# Altium schematic sheet Sheet5.SchDoc
size A3; Organization: Altium Limited; Address1: L3, 12a Rodborough Rd; Address2: Frenchs Forest; Address3: NSW; Address4: Australia 2086; SheetNumber: 5; SheetTotal: 6
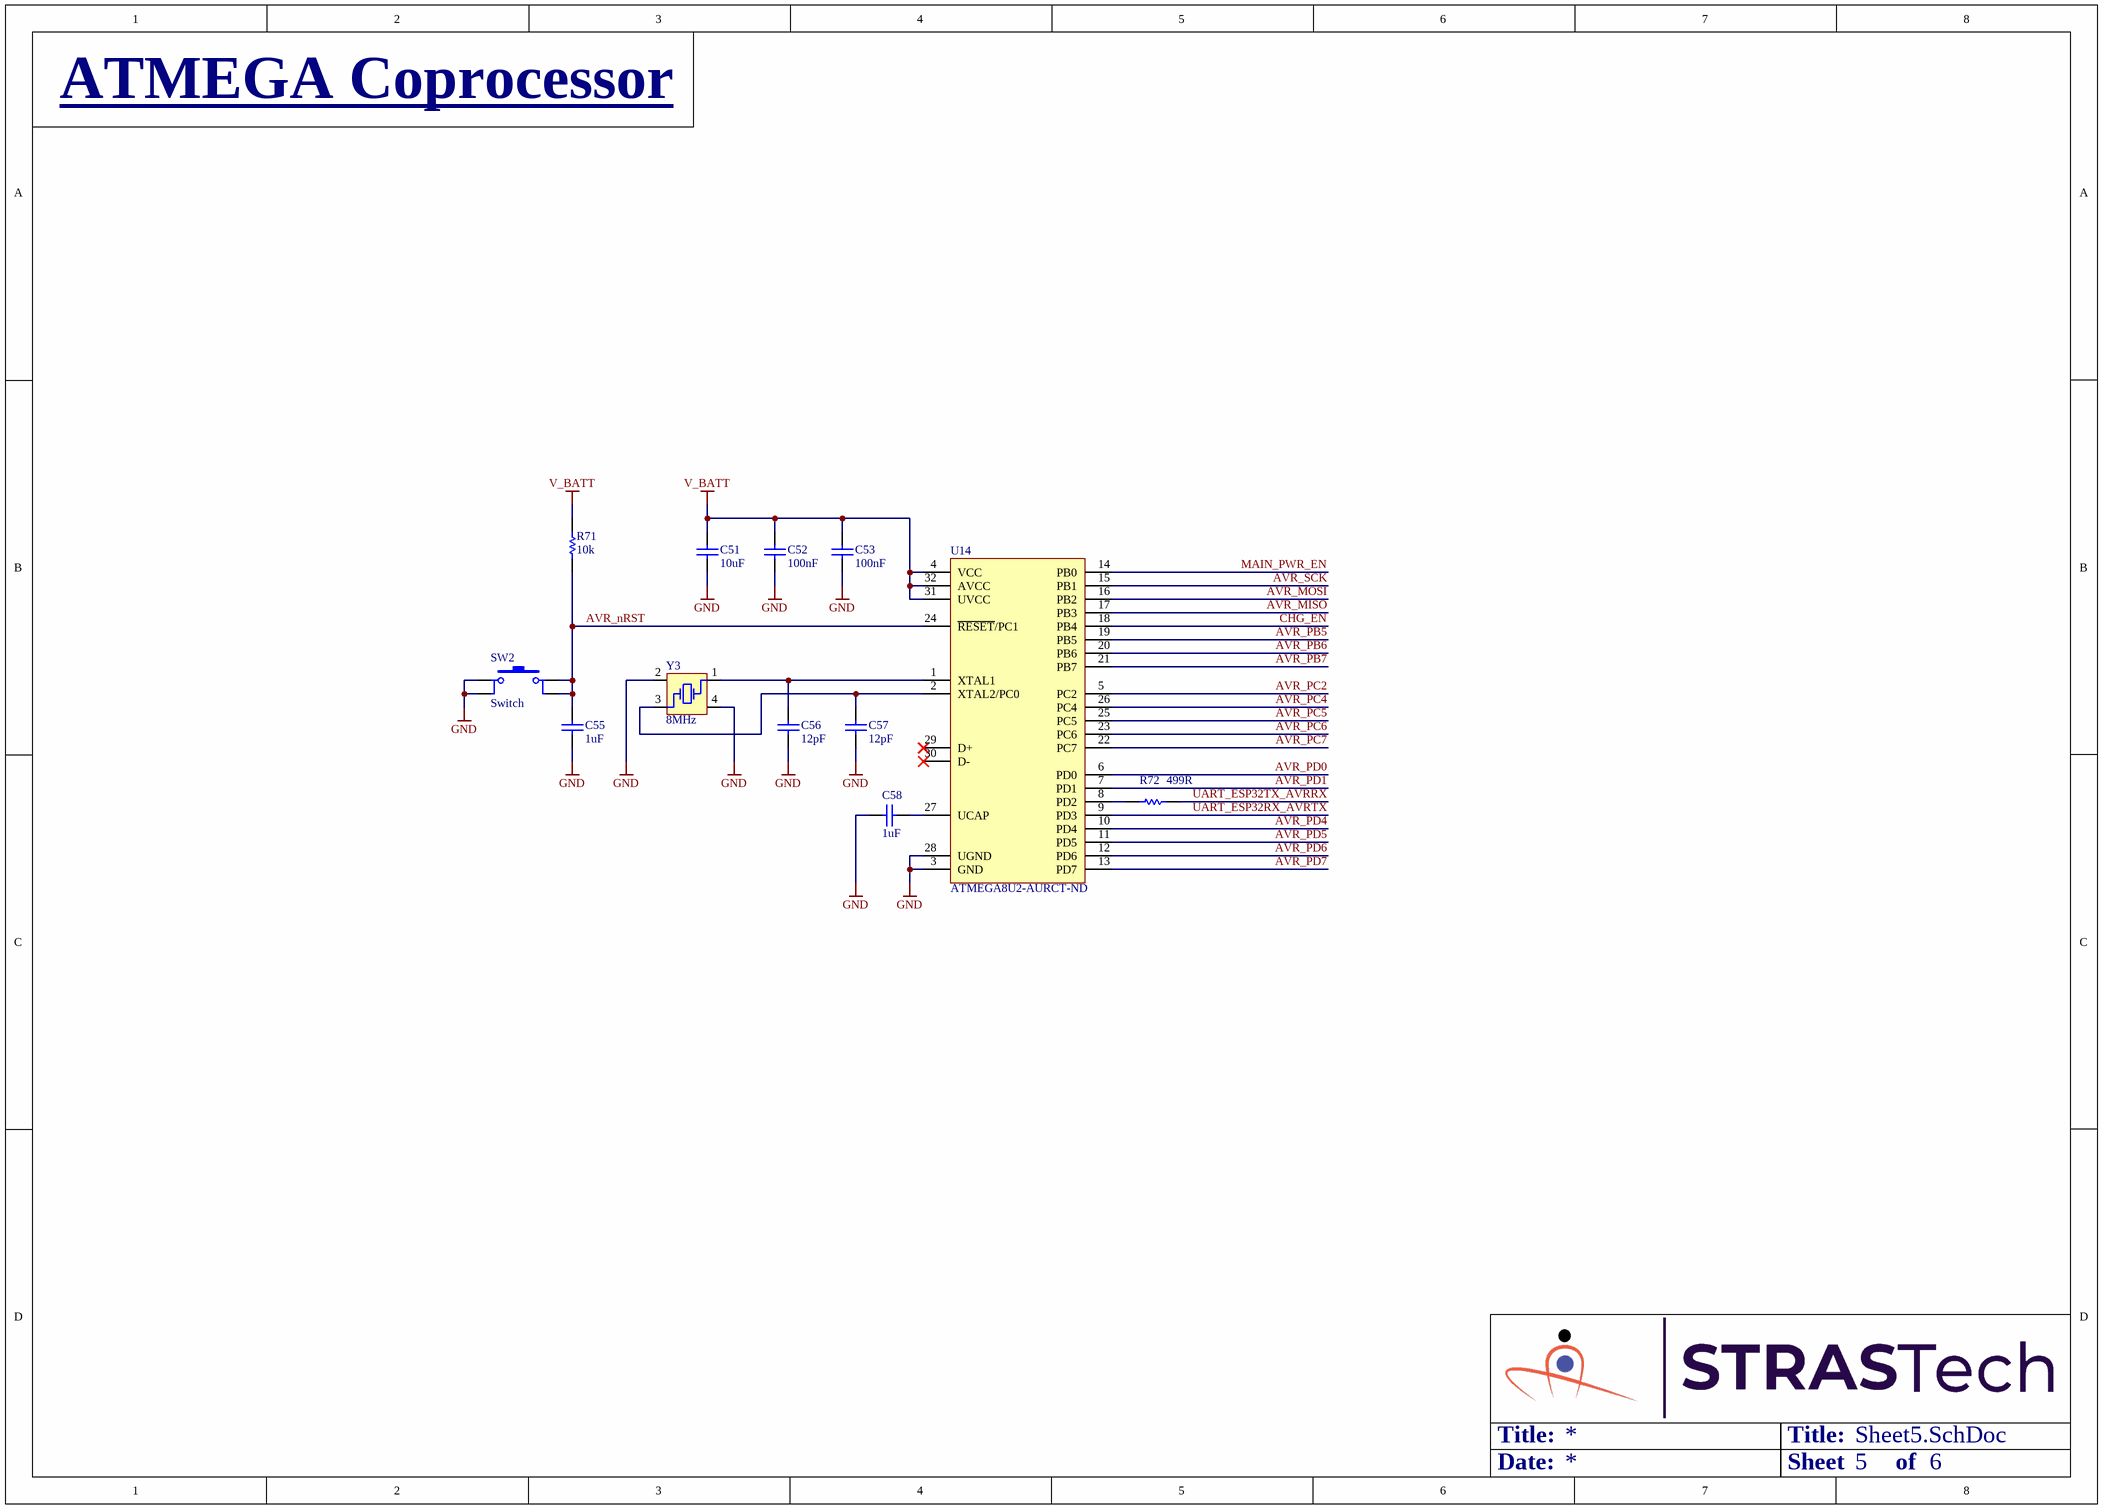
[diagram p0: Sheet5.SchDoc]

## Parts
C51  10uF  [Cap,SMD,0402]
C52  100nF  [Cap,SMD,0402]
C53  100nF  [Cap,SMD,0402]
C55  1uF  [Cap,SMD,0402]
C56  12pF  [Cap,SMD,0402]
C57  12pF  [Cap,SMD,0402]
C58  1uF  [Cap,SMD,0402]
R71  10k  [RES,0402]
R72  499R  [RES,0402]
SW2  Switch  [Switch,Tactile,Micro,SPST-NO,SMD]
U14  ATMEGA8U2-AURCT-ND  [IC,TQFP-32,7x7,P0.8MM]
Y3  8MHz  [XTAL,SMD,4 Pin]

## Nets
GND: C51.1 C52.1 C53.1 C55.2 C56.2 C57.2 C58.1 SW2.1 SW2.2 U14.3(GND) U14.28(UGND) Y3.2(GND) Y3.4(GND)
V_BATT: C51.2 C52.2 C53.2 R71.1 U14.4(VCC) U14.31(UVCC) U14.32(AVCC)
AVR_MISO: U14.17(PB3)
AVR_MOSI: U14.16(PB2)
AVR_nRST: C55.1 R71.2 SW2.3 SW2.4 U14.24(~{RESET}/PC1)
AVR_PB5: U14.19(PB5)
AVR_PB6: U14.20(PB6)
AVR_PB7: U14.21(PB7)
AVR_PC2: U14.5(PC2)
AVR_PC4: U14.26(PC4)
AVR_PC5: U14.25(PC5)
AVR_PC6: U14.23(PC6)
AVR_PC7: U14.22(PC7)
AVR_PD0: U14.6(PD0)
AVR_PD1: U14.7(PD1)
AVR_PD4: U14.10(PD4)
AVR_PD5: U14.11(PD5)
AVR_PD6: U14.12(PD6)
AVR_PD7: U14.13(PD7)
AVR_SCK: U14.15(PB1)
CHG_EN: U14.18(PB4)
MAIN_PWR_EN: U14.14(PB0)
UART_ESP32RX_AVRTX: U14.9(PD3)
UART_ESP32TX_AVRRX: R72.2
NetC56_1: C56.1 U14.1(XTAL1) Y3.1(OSC1)
NetC57_1: C57.1 U14.2(XTAL2/PC0) Y3.3(OSC2)
NetC58_2: C58.2 U14.27(UCAP)
NetR72_1: R72.1 U14.8(PD2)

Not connected (* = marked no-connect by the designer): U14 29(D+)* 30(D-)*

## Notes on the sheet
- ATMEGA Coprocessor
- Title:
- Date:
- Sheet
- of
- Title
- Size:
- A3
- Revision:
- Design By:

## Library data of the parts
C51 = CAP,Cer,10uF,10VDC,X5R,0402: 10 µF ±20% 10V Ceramic Capacitor X5R 0402 (1005 Metric); Vendor Part Number: 1276-1450-1-ND; Manufacturer: Samsung Electro-Mechanics; Manufacturer Part Number: CL05A106MP5NUNC; Vendor: Digikey; HelpURL: https://media.digikey.com/pdf/Data%20Sheets/Samsung%20PDFs/CL05A106MP5NUNC_Spec.pdf; CreatedBy: Judd Foster
C52 C53 = CAP,Cer,100nF,25VDC,X7R,0402: 0.1µF ±10% 25V Ceramic Capacitor X7R 0402 (1005 Metric); Vendor Part Number: 490-14603-1-ND; Manufacturer: Murata Electronics; Manufacturer Part Number: GRM155R71E104KE14J; Vendor: Digikey; HelpURL: https://search.murata.co.jp/Ceramy/image/img/A01X/G101/ENG/GRM155R71E104KE14-01.pdf; CreatedBy: Judd Foster
C55 C58 = CAP,Cer,1uF,35VDC,X5R,0402: 1 µF ±10% 35V Ceramic Capacitor X5R 0402 (1005 Metric); Vendor Part Number: 445-9073-1-ND; Manufacturer: TDK Corporation; Manufacturer Part Number: C1005X5R1V105K050BC; Vendor: Digikey; HelpURL: https://product.tdk.com/info/en/catalog/datasheets/mlcc_commercial_general_en.pdf?ref_disty=digikey; CreatedBy: Judd Foster
C56 C57 = CAP,Cer,12pF,50VDC,C0G/NP0,0402: 12pF ±5% 50V Ceramic Capacitor C0G, NP0 0402 (1005 Metric); Vendor Part Number: 311-1016-1-ND; Manufacturer: Yageo; Manufacturer Part Number: CC0402JRNPO9BN120; Vendor: Digikey; HelpURL: https://www.yageo.com/upload/media/product/productsearch/datasheet/mlcc/UPY-GP_NP0_16V-to-50V_18.pdf; CreatedBy: Judd Foster
R71 = RES,10k,5%,0.063W,0402: 10 kOhms ±5% 0.063W, 1/16W Chip Resistor 0402 (1005 Metric) Automotive AEC-Q200 Thick Film; Vendor Part Number: RMCF0402JT10K0CT-ND; Manufacturer: Stackpole Electronics Inc; Manufacturer Part Number: RMCF0402JT10K0; Vendor: DIgikey; HelpURL: https://www.seielect.com/catalog/sei-rmcf_rmcp.pdf; CreatedBy: Judd Foster
R72 = RES,499R,1%,0.063W,0402: 499 Ohms ±1% 0.063W, 1/16W Chip Resistor 0402 (1005 Metric) Automotive AEC-Q200 Thick Film; Manufacturer: Stackpole Electronics Inc; Manufacturer Part Number: RMCF0402FT499R; Vendor Part Number: RMCF0402FT499RCT-ND; Vendor: Digikey; CreatedBy: Judd Foster; HelpURL: https://www.seielect.com/catalog/sei-rmcf_rmcp.pdf
SW2 = Switch,Tactile,SPST-NO,SMD,H1.5: Tactile Switch SPST-NO Top Actuated Surface Mount; Manufacturer: C&K; Manufacturer Part Number: PTS525SM15SMTR2 LFS; Vendor Part Number: CKN9104CT-ND; Vendor: Digikey; CreatedBy: Judd Foster; HelpURL: https://www.ckswitches.com/media/1467/pts525.pdf
U14 = ATMEGA8U2-AURCT-ND: AVR series Microcontroller IC 8-Bit 16MHz 8KB (4K x 16) FLASH 32-TQFP (7x7); Manufacturer: Microchip Technology; Vendor: Digikey; Manufacturer Part Number: ATMEGA8U2-AUR; Vendor Part Number: ATMEGA8U2-AURCT-ND; CreatedBy: Judd Foster; HelpURL: https://ww1.microchip.com/downloads/en/DeviceDoc/7799S.pdf
Y3 = XTAL,8MHz,12pF,SMD: 8 MHz ±20ppm Crystal 12pF 400 Ohms 4-SMD, No Lead; Manufacturer: ECS Inc.; Manufacturer Part Number: ECS-80-12-33-JGN-TR; Vendor Part Number: 50-ECS-80-12-33-JGN-CT-ND; Vendor: Digikey; CreatedBy: Judd Foster; HelpURL: https://www.mouser.ca/datasheet/2/122/ecx_32-1100709.pdf